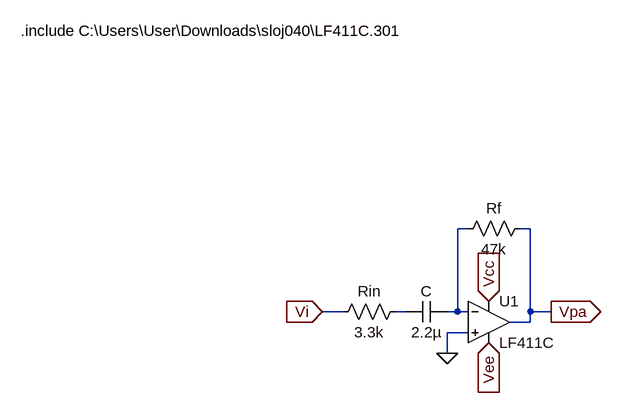
[diagram p0: schematic preamp.asc]
preamp.asc, the LTspice schematic file:
Version 4
SHEET 1 1208 680
WIRE 592 32 576 32
WIRE 688 32 672 32
WIRE 400 160 368 160
WIRE 496 160 480 160
WIRE 576 160 576 32
WIRE 576 160 560 160
WIRE 592 160 576 160
WIRE 688 160 688 32
WIRE 720 160 688 160
WIRE 688 176 688 160
WIRE 688 176 656 176
WIRE 592 192 560 192
WIRE 560 224 560 192
FLAG 560 224 0
FLAG 368 160 Vi
IOPIN 368 160 In
FLAG 624 144 Vcc
IOPIN 624 144 In
FLAG 624 208 Vee
IOPIN 624 208 In
FLAG 720 160 Vpa
IOPIN 720 160 Out
SYMBOL res 496 144 R90
WINDOW 0 0 56 VBottom 2
WINDOW 3 32 56 VTop 2
SYMATTR InstName Rin
SYMATTR Value 3.3k
SYMBOL cap 560 144 R90
WINDOW 0 0 32 VBottom 2
WINDOW 3 32 32 VTop 2
SYMATTR InstName C
SYMATTR Value 2.2µ
SYMBOL OpAmps\\opamp2 624 112 R0
SYMATTR InstName U1
SYMATTR Value LF411C
SYMBOL res 688 16 R90
WINDOW 0 0 56 VBottom 2
WINDOW 3 32 56 VTop 2
SYMATTR InstName Rf
SYMATTR Value 47k
TEXT -96 -272 Left 2 !.include C:\\Users\\User\\Downloads\\sloj040\\LF411C.301

The netlist it stands for:
* preamp.asc
Rin N002 Vi 3.3k
C N001 N002 2.2µ
XU1 0 N001 Vcc Vee Vpa LF411C  ; pins In+ In- V+ V- OUT
Rf Vpa N001 47k
.include C:\Users\User\Downloads\sloj040\LF411C.301
.backanno
.end